# Altium schematic sheet JTAG & Reset Connection.SchDoc
size A2; SheetNumber: 7; SheetTotal: 8
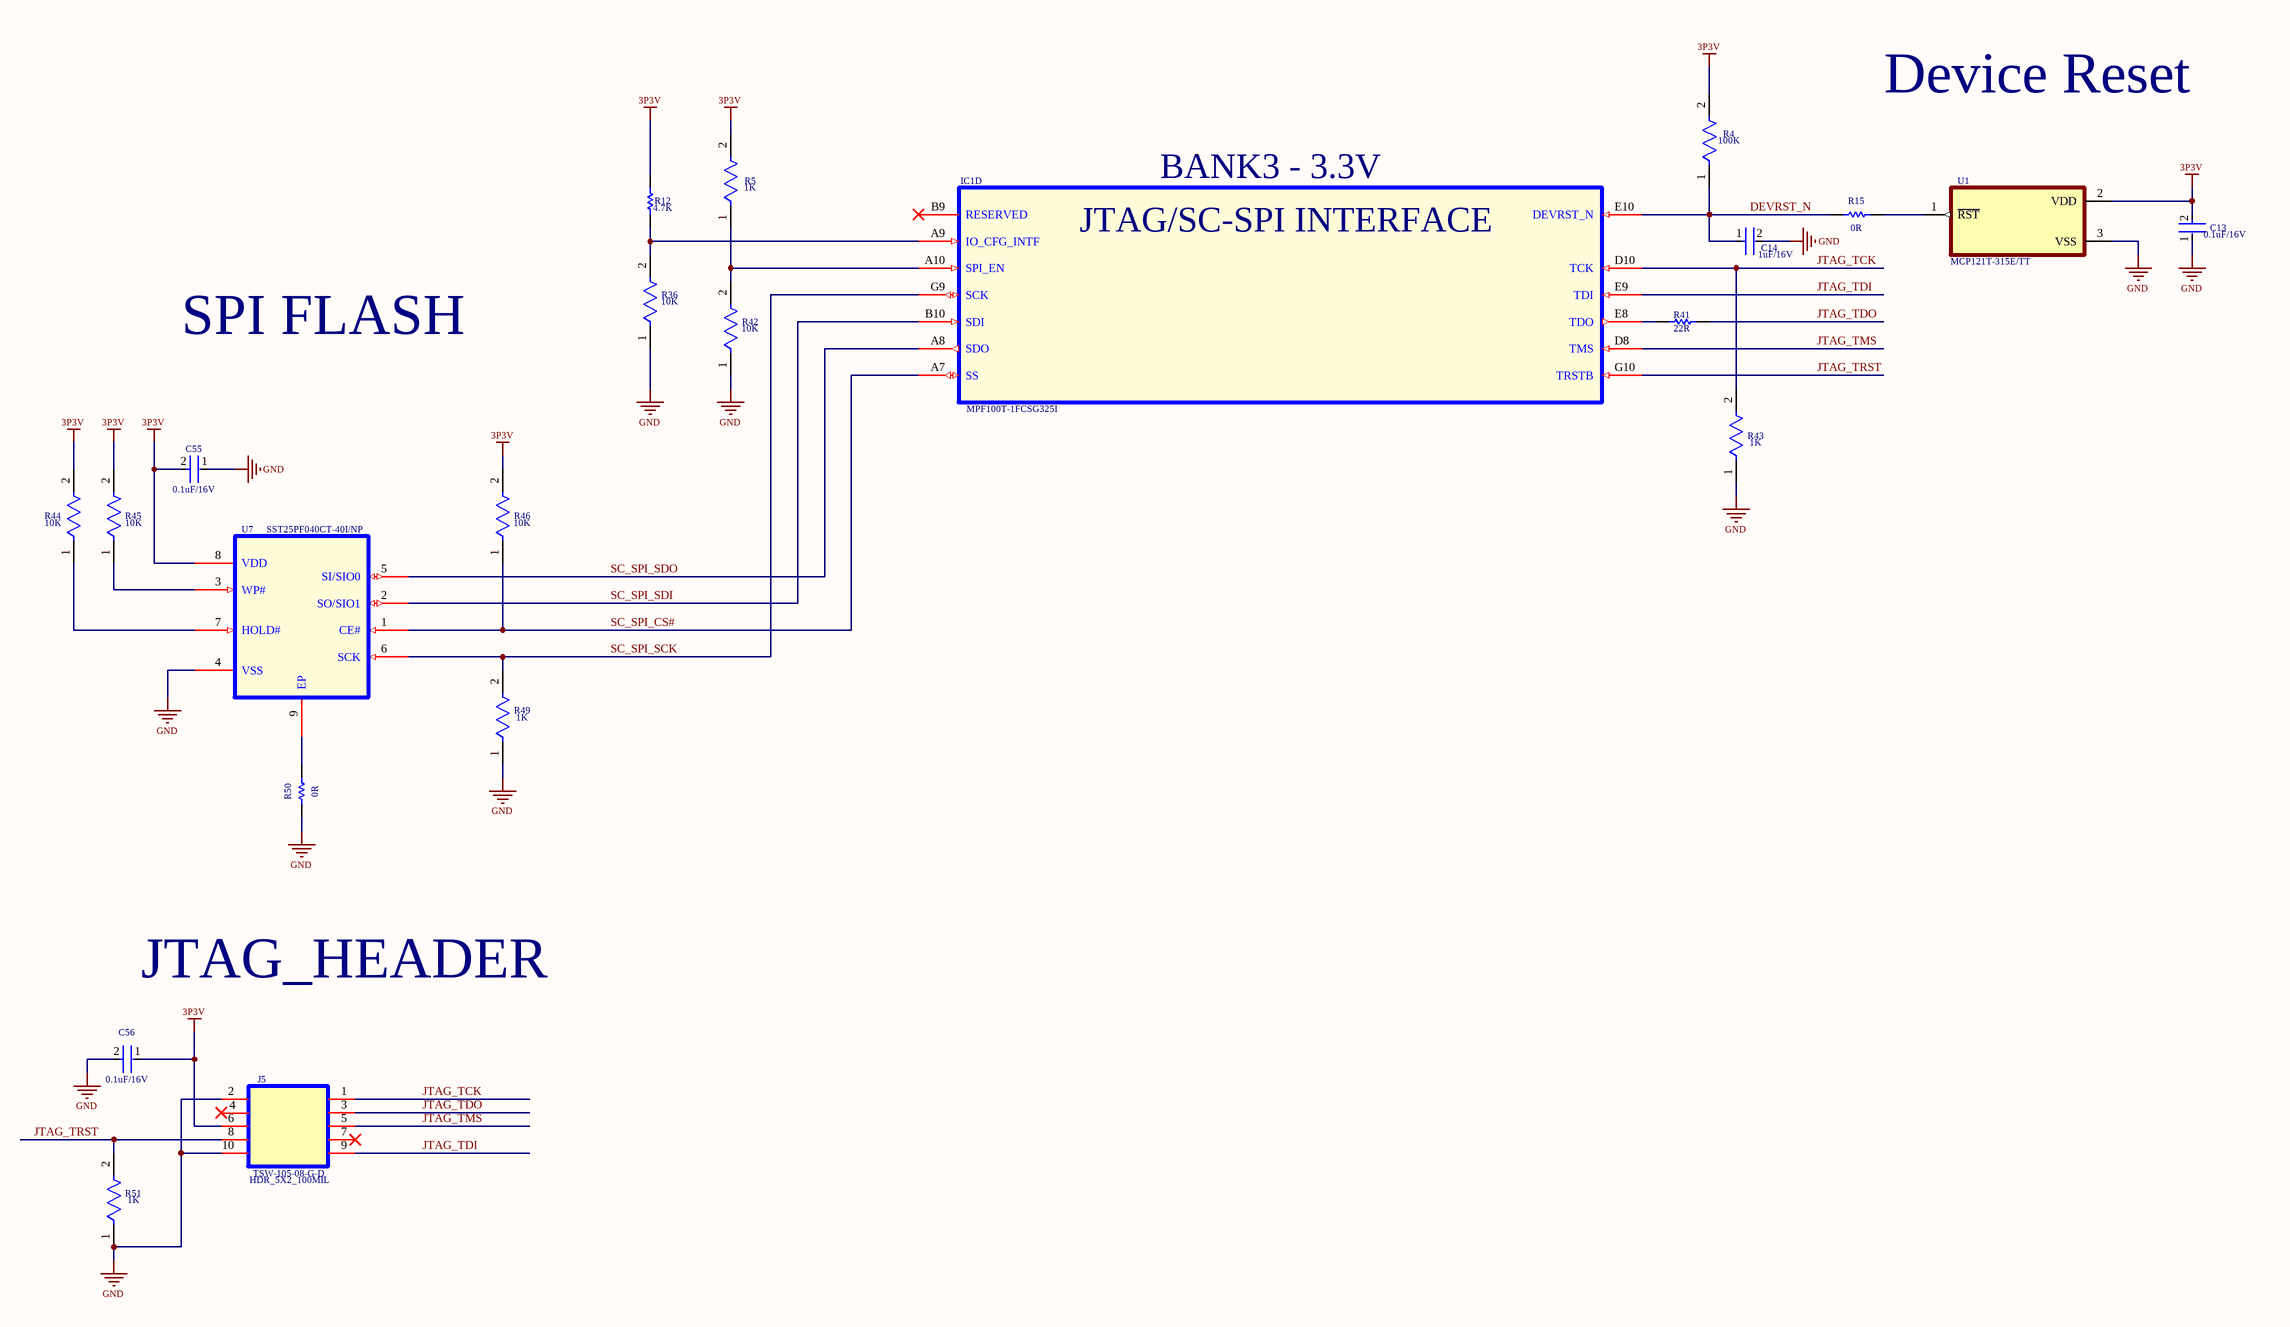
[diagram p0: JTAG & Reset Connection.SchDoc]

## Parts
C13  0.1uF/16V  [FP-GRM15-MFG]
C14  1uF/16V  [FP-0402-L_1_0_0_05-W_0_5-IPC_A]
C55  0.1uF/16V  [FP-GRM15-MFG]
C56  0.1uF/16V  [FP-GRM15-MFG]
IC1  MPF100T-1FCSG325I  [MPF100T-1FCSG325I]  (part D of 9)
J5  TSW-105-08-G-D  Parameter 1: HDR_5X2_100MIL  [TSW-105-08-G-D]
R4  100K  [FP-RC0603-0_55-MFG]
R5  1K  [FP-RC0603-0_55-IPC_C]
R12  4.7K  [RESC1608X55X25LL10T15]
R15  0R  [RESC1005X40X25NL05T10]
R36  10K  [FP-RC0603-0_55-IPC_C]
R41  22R  [RESC1005X40X25LL05T10]
R42  10K  [FP-RC0603-0_55-IPC_C]
R43  1K  [FP-RC0603-0_55-IPC_C]
R44  10K  [FP-RC0603-0_55-IPC_C]
R45  10K  [FP-RC0603-0_55-IPC_C]
R46  10K  [FP-RC0603-0_55-IPC_C]
R49  1K  [FP-RC0603-0_55-IPC_C]
R50  0R  [RESC1005X40X25NL05T10]
R51  1K  [FP-RC0603-0_55-IPC_C]
U1  MCP121T-315E/TT  [MCP121T-315E/TT]
U7  SST25PF040CT-40I/NP  [SST25PF040CT-40I/NP]

## Nets
3P3V: C13.2 C55.2 C56.1 J5.6 R4.2 R5.2 R12.2 R44.2 R45.2 R46.2 U1.2(VDD) U7.8(VDD)
GND: C13.1 C14.2 C55.1 C56.2 J5.2 J5.10 R36.1 R42.1 R43.1 R49.1 R50.1 R51.1 U1.3(VSS) U7.4(VSS)
DEVRST_N: C14.1 IC1.E10(DEVRST_N) R4.1 R15.1
JTAG_TCK: IC1.D10(TCK) J5.1 R43.2
JTAG_TDI: IC1.E9(TDI) J5.9
JTAG_TDO: J5.3 R41.1
JTAG_TMS: IC1.D8(TMS) J5.5
JTAG_TRST: IC1.G10(TRSTB) J5.8 R51.2
SC_SPI_CS#: IC1.A7(SS) R46.1 U7.1(CE#)
SC_SPI_SCK: IC1.G9(SCK) R49.2 U7.6(SCK)
SC_SPI_SDI: IC1.B10(SDI) U7.2(SO/SIO1)
SC_SPI_SDO: IC1.A8(SDO) U7.5(SI/SIO0)
NetIC1_A9: IC1.A9(IO_CFG_INTF) R12.1 R36.2
NetIC1_A10: IC1.A10(SPI_EN) R5.1 R42.2
NetIC1_E8: IC1.E8(TDO) R41.2
NetR15_2: R15.2 U1.1(~{RST})
NetR44_1: R44.1 U7.7(HOLD#)
NetR45_1: R45.1 U7.3(WP#)
NetR50_2: R50.2 U7.9(EP)

Not connected (* = marked no-connect by the designer): IC1 B9(RESERVED)*; J5 4(03) 7(08)*

## Notes on the sheet
- Device Reset
- SPI FLASH
- JTAG_HEADER
- (in symbol MPF100T-1FCSG325I, part D) BANK3 - 3.3V; JTAG/SC-SPI INTERFACE

## Library data of the parts
C13 C55 C56 = CMP-2100-03641-2: CAP CER 0.1UF 16V X7R 0402; Manufacturer Part Number: GRM155R71C104KA88D; Manufacturer: Murata; Standoff Height: 0mm; Tolerance: 10%; Voltage Rating: 16Vdc; Material: Ceramic; Capacitance: 0.10μF; Value: 0.10μF; RoHS: TRUE; Temperature Characteristic: X7R; Octopart: https://octopart.com/grm155r71c104ka88d-murata-196880; Digikey Description: CAP CER 0.1UF 16V X7R 0402; Device Class L3: Ceramic Capacitors; Height: 0.55mm; ComponentLink2Description: Datasheet; Temperature Range Low: -55°C; Ipc Land Pattern Name: CAPC10050X219; ComponentLink2URL: https://search.murata.co.jp/Ceramy/image/img/A01X/G101/ENG/GRM155R71H471KA01-01A.pdf; Device Class L1: Passive Components; Lead Free: yes; Category: Cap; Package: GRM15; Temperature: -55°C to +125°C; Device Class L2: Capacitors; Temperature Range High: +125°C; Mouser Description: 0402 0.1 uF 16V ±10 % Tolerance X7R SMT Multilayer Ceramic Capacitor
C14 = CMP-14477-000104-2: None; Tolerance: 10%; Voltage Rating: 16V; Dielectric: X5R; Capacitance: 1uF; Packaging: Tape and Reel; Depth: 0.5mm; Mount: Surface Mount; Thickness: 0.022inch; Package Quantity: 1; Min Operating Temperature: -55°C; Series: M; Voltage Rating (DC): 16V; Termination: SMD/SMT; Case/Package: 0402; Number of Pins: 2; Case Code (Imperial): 0402; Length: 1mm; Halogen Free: Halogen Free; Case Code (Metric): 1005; Width: 0.02inch; RoHS Compliant: Yes; Radiation Hardening: No; Max Operating Temperature: 85°C; Height: 0.5mm; Construction: Flat
IC1 = MPF100T-1FCSG325I: Part_Number: J00001; Part_Name: Jumper; ID: 110; Mounting_Type: SMT; ComponentLink1Description: Datasheet
J5 = TSW-105-08-G-D: Jumper; Part_Number: J00001; ID: 110; Mounting_Type: SMT; Part_Name: Jumper; ComponentLink1Description: Datasheet
R4 = CMP-2100-03662-2: RES SMD 100K OHM 1% 1/10W 0603; Voltage Rating (DC): 50V; Resistance: 100kR; Max Power Dissipation: 100mW; Temperature Coefficient: 100ppm/°C; Working Voltage: 75V; Length: 1.6mm; Lead Free: Lead Free; Number of Terminations: 2; Packaging: Tape and Reel; Voltage Rating: 50V; Termination: SMD/SMT; Width: 0.8mm; Resistor Type: Thick Film; Resistance Tolerance: 1%; Features: Moisture Resistant; Height: 0.45mm; Construction: Rectangular; Case/Package: 0603; Military Standard: Not; Case Code (Imperial): 0603; Series: RC; Technology: THICK FILM; Depth: 0.8mm; RoHS Compliant: Yes; REACH SVHC: No SVHC; Min Operating Temperature: -55°C; Case Code (Metric): 1608; Max Operating Temperature: 155°C; Power Rating: 100mW; Number of Pins: 2; Tolerance: 1%
R5 R43 R49 R51 = CMP-1659-00009-5: RES 1K OHM 1% 1/10W 0603; Resistance: 1kR; Voltage Rating: 50V; Power Rating: 100mW; Temperature Coefficient: 100ppm/°C; Military Standard: Not; REACH SVHC: No SVHC; Size Code: 0603; Features: Moisture Resistant; Number of Terminations: 2; Technology: THICK FILM; Series: RC; Case Code (Metric): 1608; Resistance Tolerance: 1%; Resistor Type: Thick Film; Termination: SMD/SMT; Contact Plating: Tin; Radiation Hardening: No; Min Operating Temperature: -55°C; Max Operating Temperature: 155°C; Packaging: Tape and Reel; Max Power Dissipation: 100mW; RoHS Compliant: Yes; Height: 0.45mm; Lead Free: Lead Free; Case/Package: 0603; Length: 1.6mm; Tolerance: 1%; Case Code (Imperial): 0603; Construction: Rectangular; Depth: 0.8mm
R12 = CMP-2000-06942-1: Chip Resistor, 4.7 KOhm, +/- 1%, 0.1 W, -55 to 155 degC, 0603 (1608 Metric), RoHS, Tape and Reel; Manufacturer: Yageo; Power Rating: 100mW; Temperature Coefficient: 100PPM/C; Resistance: 4.7kOhms; Voltage Rating: 50V; Package Reference: 0603; Series: RC; Datasheet Version: Rev. 7, 05/2017; Packaging: Reel; Termination Style: SMD/SMT; Datasheet URL: http://www.yageo.com/documents/recent/PYu-RC_Group_51_RoHS_L_7.pdf; Manufacturer URL: http://www.yageo.com/; Package Description: 2-Pin Surface Mount Device, Body 1.6 x 0.8 mm; Case Code - mm: 1608; Case Code - in: 0603; Mounting Technology: SurfaceMount; Operating Temperature Range: -55Cto+155C; Tolerance: 1%; Product: ThickFilmResistorsGeneralPurpose
R15 R50 = CMP-1011-00001-2: Manufacturer: Yageo / Phycomp; Part Number: RC0402JR-070RL
R36 R42 R44-R46 = CMP-2100-03664-2: RES 10K OHM 1% 1/10W 0603; Voltage Rating: 75V; Voltage Rating (DC): 50V; Resistance: 10kR; Power Rating: 100mW; Temperature Coefficient: 100ppm/°C; Depth: 0.8mm; Termination: SMD/SMT; Resistor Type: Thick Film; Series: RC; Construction: Rectangular; Features: Moisture Resistant; Packaging: Tape and Reel; Min Operating Temperature: -55°C; Number of Terminations: 2; Lead Pitch: 0.3mm; RoHS Compliant: Yes; Case/Package: 0603; Resistance Tolerance: 1%; Military Standard: Not; Weight: 7.1E-05oz; Number of Pins: 2; Tolerance: 1%; Length: 1.6mm; Case Code (Imperial): 0603; Lead Free: Lead Free; Width: 0.8mm; Max Power Dissipation: 100mW; Height: 0.45mm; Max Operating Temperature: 155°C; Case Code (Metric): 1608; Size Code: 0603
R41 = CMP-2002-07520-1: Manufacturer: Yageo / Phycomp; Part Number: RC0402FR-0722RL
U1 = MCP121T-315E/TT: Jumper; Part_Number: J00001; ID: 110; Mounting_Type: SMT; Part_Name: Jumper; ComponentLink1Description: Datasheet
U7 = SST25PF040CT-40I/NP: Jumper; Part_Number: J00001; ID: 110; Mounting_Type: SMT; Part_Name: Jumper; ComponentLink1Description: Datasheet